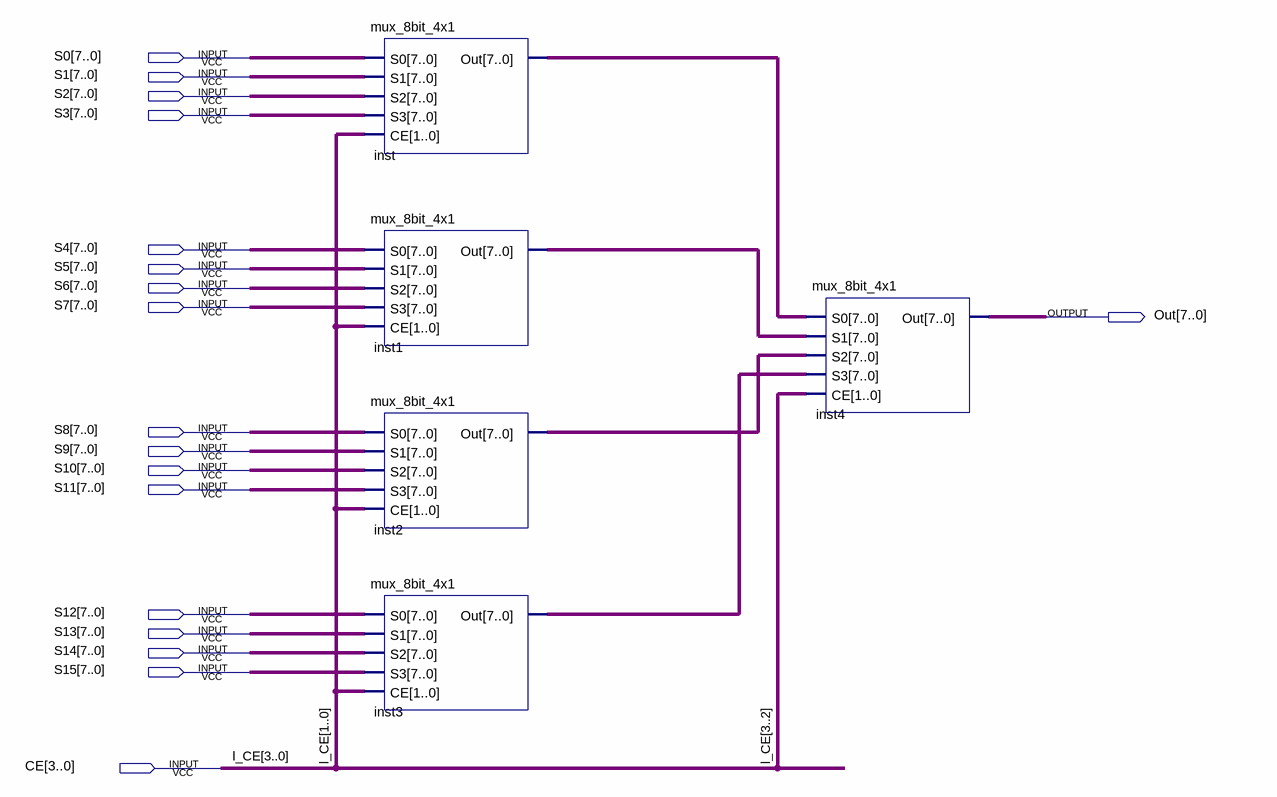
[diagram p0: schematic sheet]
// Quartus schematic mux_8bit_16x1.bdf as structural Verilog: 5 symbols, 18 pins
module mux_8bit_16x1 (
  input  [7:0] S0,
  input  [7:0] S1,
  input  [7:0] S2,
  input  [7:0] S3,
  input  [7:0] S4,
  input  [7:0] S5,
  input  [7:0] S6,
  input  [7:0] S7,
  input  [7:0] S8,
  input  [7:0] S9,
  input  [7:0] S10,
  input  [7:0] S11,
  input  [7:0] S12,
  input  [7:0] S13,
  input  [7:0] S14,
  input  [7:0] S15,
  input  [3:0] CE,
  output [7:0] Out
);

  wire [7:0] inst1_out, inst2_out, inst3_out, inst_out;

  mux_8bit_4x1 inst (.S0(S0), .S1(S1), .S2(S2), .S3(S3), .CE(CE[1:0]), .Out(inst_out));
  mux_8bit_4x1 inst1 (.S0(S4), .S1(S5), .S2(S6), .S3(S7), .CE(CE[1:0]), .Out(inst1_out));
  mux_8bit_4x1 inst2 (.S0(S8), .S1(S9), .S2(S10), .S3(S11), .CE(CE[1:0]), .Out(inst2_out));
  mux_8bit_4x1 inst3 (.S0(S12), .S1(S13), .S2(S14), .S3(S15), .CE(CE[1:0]), .Out(inst3_out));
  mux_8bit_4x1 inst4 (.S0(inst_out), .S1(inst1_out), .S2(inst2_out), .S3(inst3_out), .CE(CE[3:2]), .Out(Out));

  // Other names for the same wires on the sheet: l_CE[3:0] = CE
endmodule
